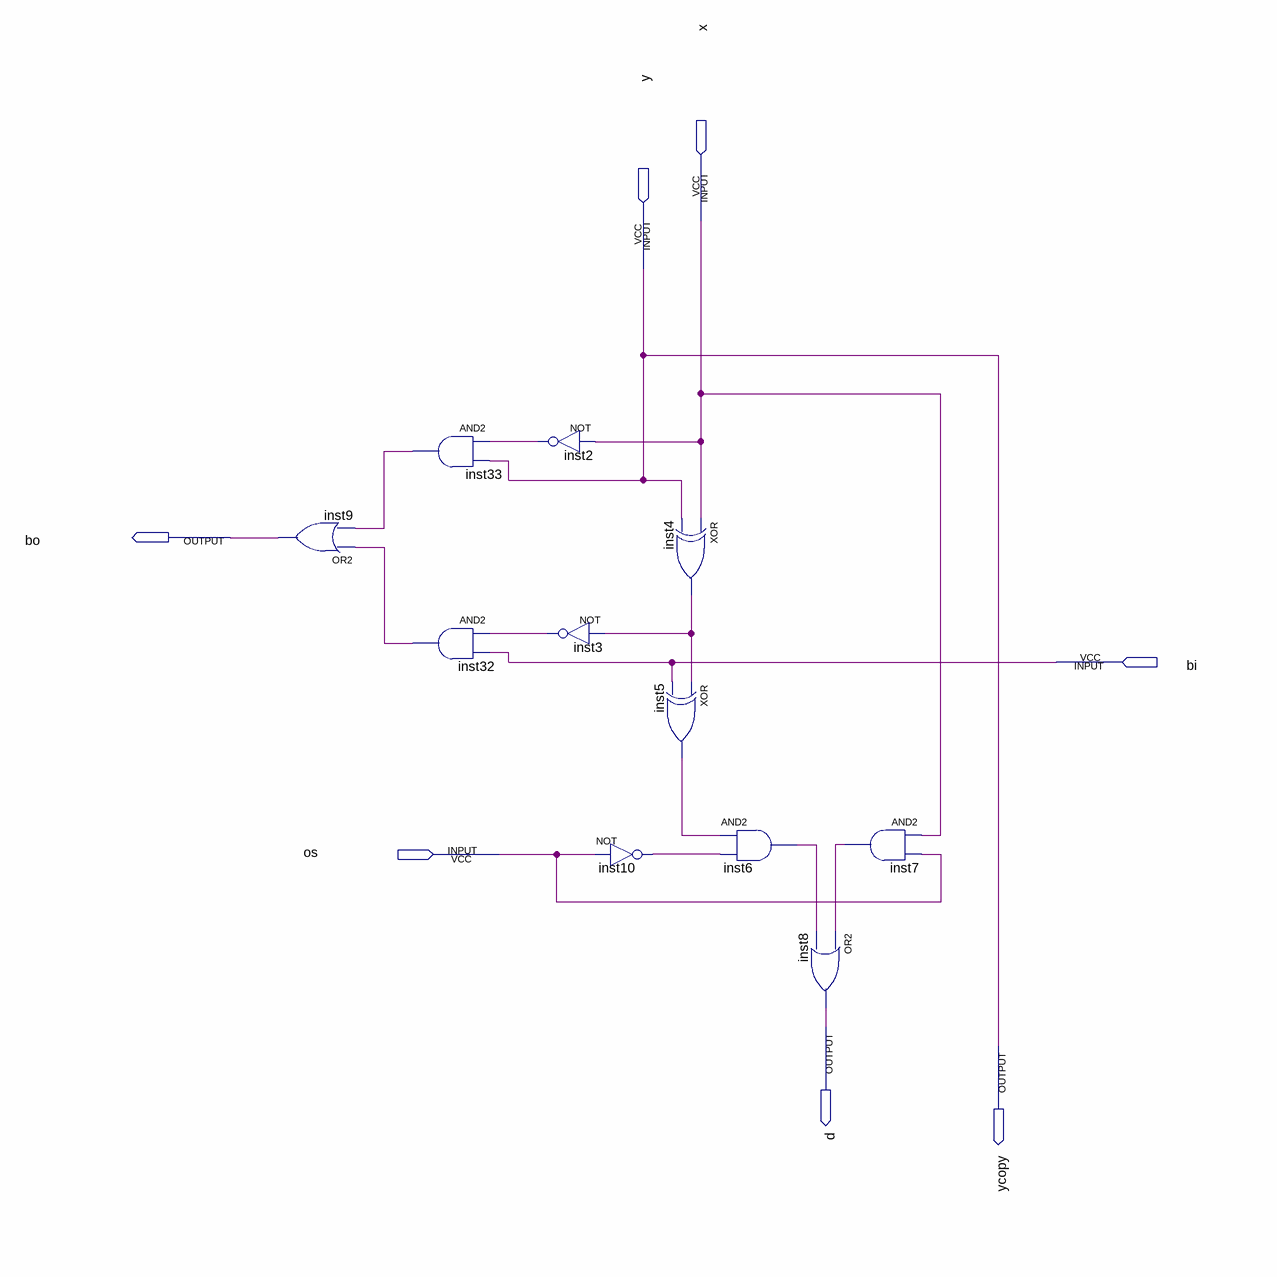
[diagram p0: schematic sheet]
// Quartus schematic divisor_1bit(1).bdf as structural Verilog: 11 symbols, 7 pins
module \divisor_1bit(1)  (
  input  x,
  input  y,
  input  bi,
  input  os,
  output bo,
  output d,
  output ycopy
);

  wire inst2_out, inst3_out, inst4_out, inst5_out, inst6_out, inst7_out, inst10_out, inst32_out, inst33_out;

  or inst9 (bo, inst32_out, inst33_out);
  and inst33 (inst33_out, inst2_out, y);
  and inst32 (inst32_out, inst3_out, bi);
  not inst2 (inst2_out, x);
  not inst3 (inst3_out, inst4_out);
  not inst10 (inst10_out, os);
  xor inst4 (inst4_out, x, y);
  xor inst5 (inst5_out, inst4_out, bi);
  and inst6 (inst6_out, inst5_out, inst10_out);
  or inst8 (d, inst7_out, inst6_out);
  and inst7 (inst7_out, x, os);

  assign ycopy = y;
endmodule
